# EAGLE design poe (EAGLE 6.4)
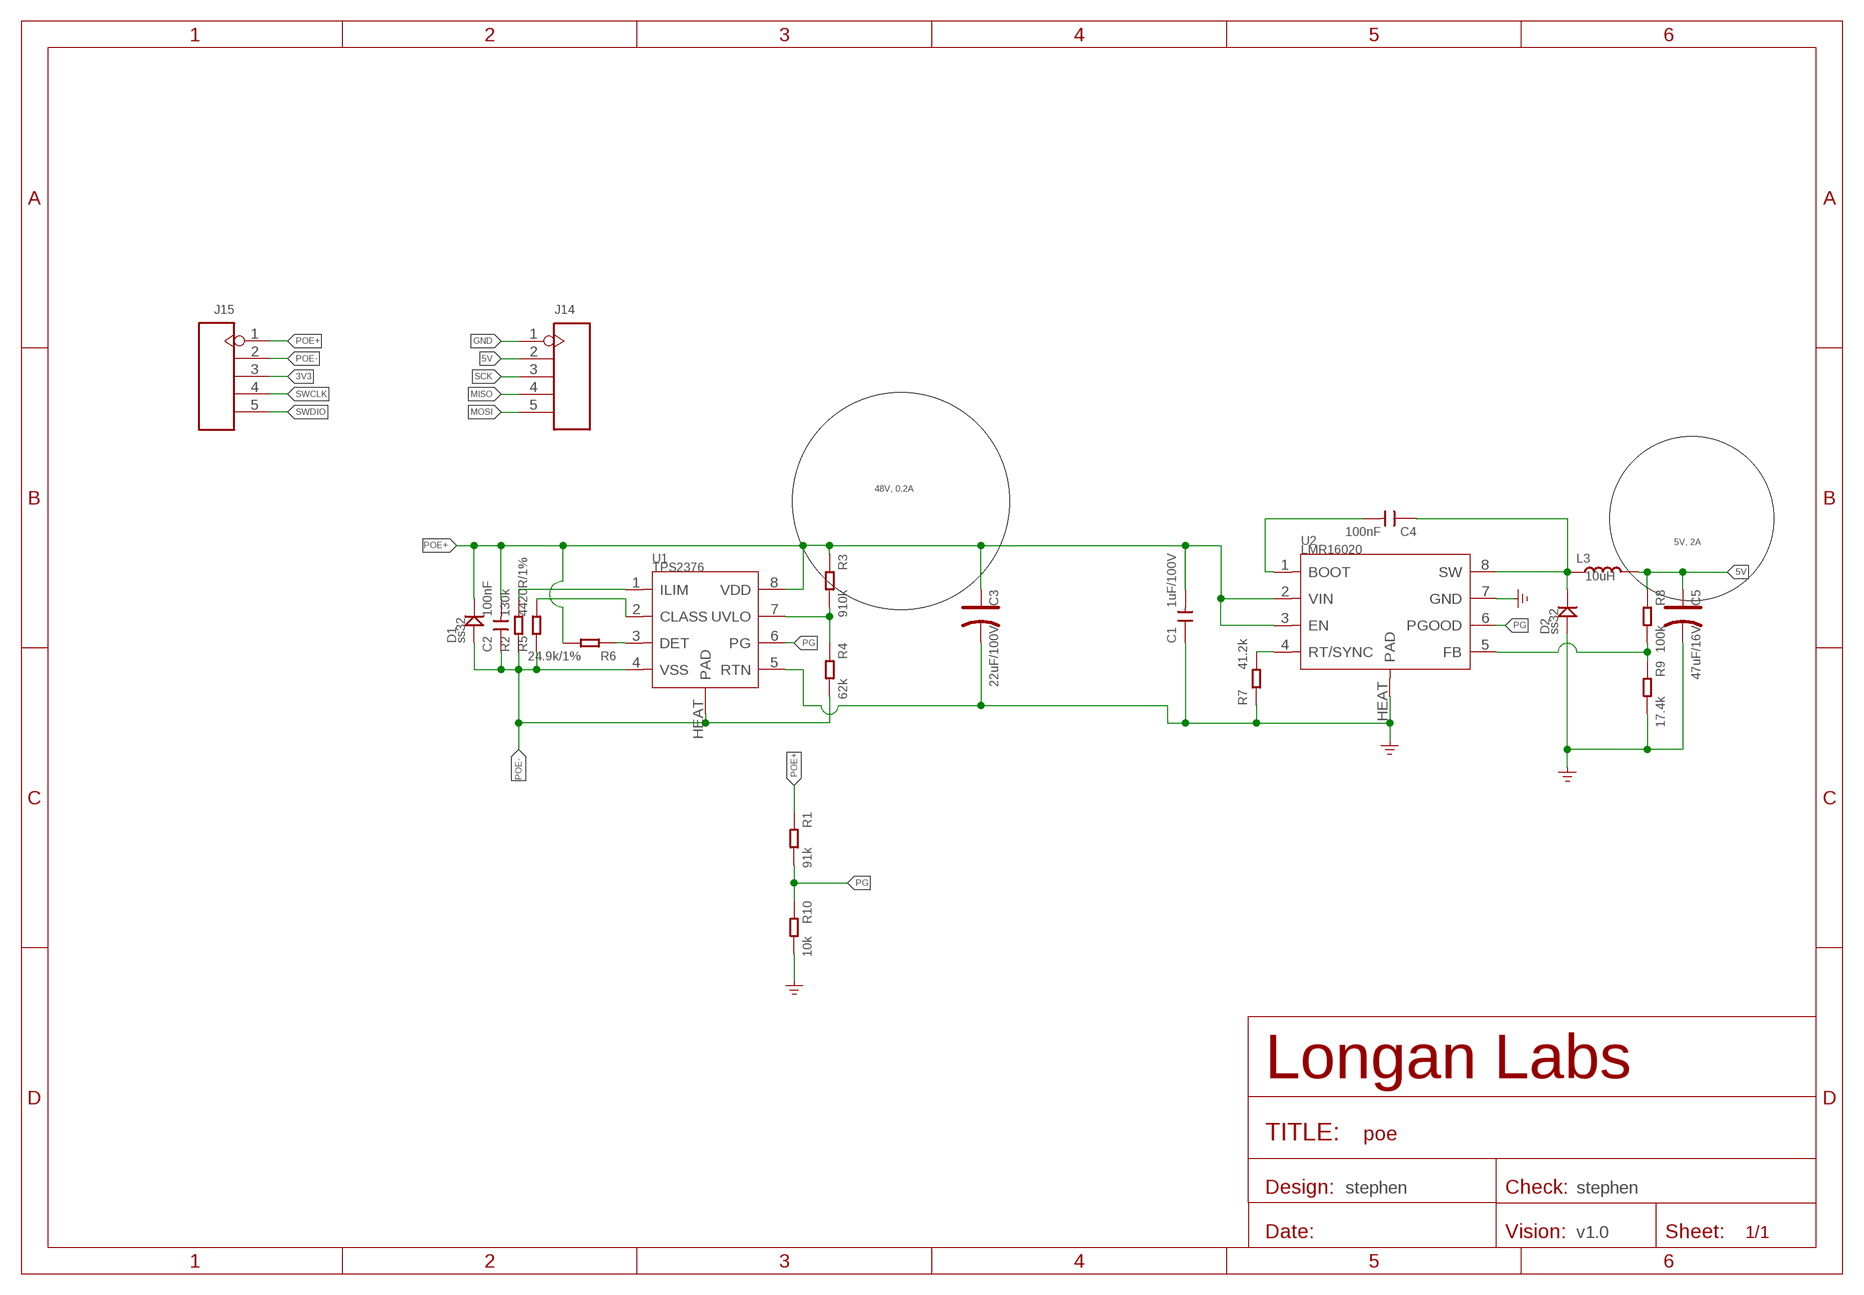
[diagram p0: schematic, sheet 1]

## Parts
C1  1uF/100V  CAP-0805  [C0805]
C2  100nF  CAP-0805  [C0805]
C3  22uF/100V  CAP-POLAR-ELECTRO-E  [ELECTRO-SMD-E-7.8MM]
C4  100nF  CAP-0603  [C0603]
C5  47uF/16V  CAP-POLAR-AVX-B  [AVX-B]
D1  ss32  DIODE'SMA'  [DO-214AC]
D2  ss32  DIODE'SMA'  [DO-214AC]
J14  HEADER-5P-2.0  [H5-2.0]
J15  HEADER-5P-2.0  [H5-2.0]
L3  10uH  INDUCTOR-6.6X7.1  [INT2-SMD-6.6X7.1X3MM]
R1  91k  RES-0603  [R0603]
R2  130k  RES-0603  [R0603]
R3  910k  RES-0603  [R0603]
R4  62k  RES-0603  [R0603]
R5  4420R/1%  RES-0603  [R0603]
R6  24.9k/1%  RES-0603  [R0603]
R7  41.2k  RES-0603  [R0603]
R8  100k  RES-0603  [R0603]
R9  17.4k  RES-0603  [R0603]
R10  10k  RES-0603  [R0603]
U1  TPS2376  CONTROLLER-TPS2376DDA-H  [SOP8G-1.27-5X3.9MM]
U2  LMR16020  PMIC-LMR16020  [SOP8G-1.27-5X3.9MM]

## Nets
3V3: J15.3
5V [usbvcc]: C5.+ J14.2 L3.2 R8.1
GND: C1.1 C3.- C5.- D2.1(+) J14.1 R7.1 R9.2 R10.2 U1.5(RTN) U2.7(GND) U2.HEAT(PAD) ; supply symbol labelled GND_POWER
MISO: J14.4
MOSI: J14.5
N$2: R2.2 U1.1(ILIM)
N$3: R5.2 U1.2(CLASS)
N$4: R6.1 U1.3(DET)
N$5: C4.2 U2.1(BOOT)
N$6: R3.2 R4.1 U1.7(UVLO)
N$7: R7.2 U2.4(RT/SYNC)
N$10: R8.2 R9.1 U2.5(FB)
N$11: C4.1 D2.2(-) L3.1 U2.8(SW)
PG: R1.2 R10.1 U1.6(PG) U2.6(PGOOD)
POE+: C1.2 C2.2 C3.+ D1.2(-) J15.1 R1.1 R3.1 R6.2 U1.8(VDD) U2.2(VIN) U2.3(EN)
POE-: C2.1 D1.1(+) J15.2 R2.1 R4.2 R5.1 U1.4(VSS) U1.HEAT(PAD)
SCK: J14.3
SWCLK: J15.4
SWDIO: J15.5

## Notes on the sheet
- 48V, 0.2A
- 5V, 2A
- stephen | stephen
- v1.0

## Library data of the parts
C1 C2 C4 = Discrete-new:CAP: Ceramic Capacitors
C3 C5 = Discrete-new:CAP-POLAR: Electrolytic Capacitors,Tantalum Capacitors and Super Capacitors
D1 D2 = Discrete-new:DIODE
J14 J15 = Connector-new:HEADER-5P
L3 = Discrete-new:INDUCTOR
R1-R10 = Discrete-new:RES
U1 = IC-new:CONTROLLER-TPS2376DDA-H
U2 = PMIC:PMIC-LMR16020

## Net classes
0 default: width 0.152 mm, drill 0.254 mm, clearance 0.152 mm
3 usbvcc: width 0.127 mm, drill 0.305 mm, clearance 0.203 mm

## Board
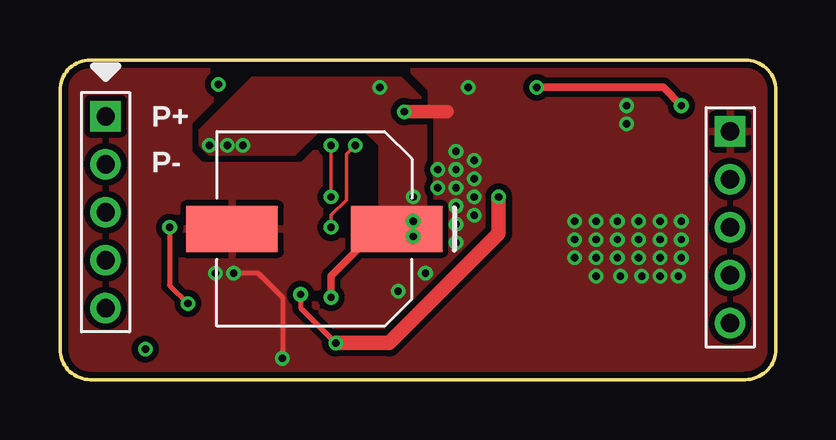
[diagram p1: board, top side]
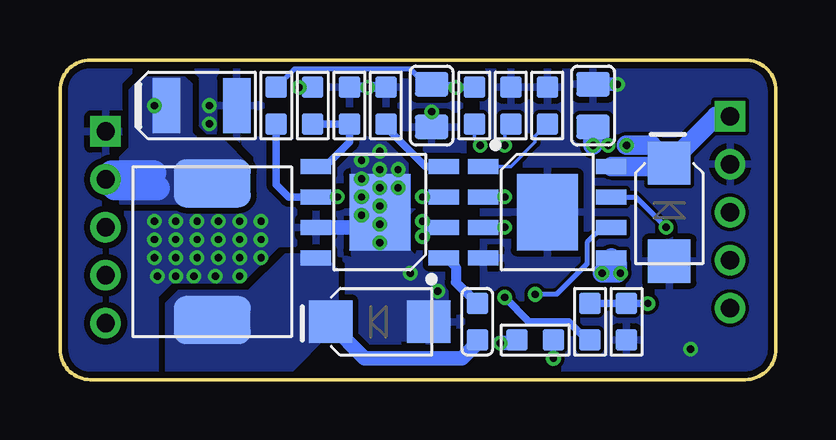
[diagram p2: board, bottom side, seen from below]

Size 29.84 x 13.34 mm. Coordinates in mm from the lower left corner, seen from the top.
Outline: 1.27,0 28.57,0 arc90 29.84,1.27 29.84,12.06 arc90 28.57,13.34 1.27,13.34 arc90 0,12.06 0,1.27 arc90 1.27,0
Copper layers (1*16): Top 0.035mm / dielectric 1.5mm / Bottom 0.035mm
Design rules "default *": minimum track width 6mil, minimum drill 12mil, track to track 6mil, track to pad 6mil, pad to pad 6mil, via to via 6mil, smd to smd 0mil, copper to edge 10mil, drill to drill 10mil, minimum pad ring 10mil, minimum via ring 6mil, stop-mask expansion 2mil, vias tented up to drill 25mil, thermal gap 10mil

### Footprints (pad centres in the part's own frame; a part is rotated, then mirrored left to right if it is on the bottom)
C0805 = smd 1.016 x 1.397: 1 -0.889,0; 2 0.889,0
ELECTRO-SMD-E-7.8MM = smd 3.81 x 1.905: + 3.429,0; - -3.429,0
C0603 = smd 0.889 x 0.889: 1 -0.762,0; 2 0.762,0
AVX-B = smd 1.143 x 2.286: + 1.46,0; - -1.46,0
DO-214AC = smd 1.8 x 1.77: 1 2.042,0; 2 -2.042,0
H5-2.0 = drill 0.762 pad 1.27 square: 1 0,4 | drill 0.762 pad 1.27: 2 0,2; 3 0,0; 4 0,-2; 5 0,-4
INT2-SMD-6.6X7.1X3MM = smd 2 x 3.2: 1 -2.85,0; 2 2.85,0
R0603 = smd 0.889 x 0.889: 1 -0.762,0; 2 0.762,0
SOP8G-1.27-5X3.9MM = smd 0.635 x 1.27: 1 -1.905,-2.667; 2 -0.635,-2.667; 3 0.635,-2.667; 4 1.905,-2.667; 5 1.905,2.667; 6 0.635,2.667; 7 -0.635,2.667; 8 -1.905,2.667 | smd 3.175 x 2.54: HEAT 0,0

### Placement (x,y rotation side)
C1  14.35,11.43 90 bottom
C2  7.62,11.43 270 bottom
C3  10.6,6.29 0 top
C4  12.45,2.41 90 bottom
C5  23.94,11.43 180 bottom
D1  4.45,6.99 270 bottom
D2  16.51,2.41 0 bottom
J14  27.94,6.35 0 top
J15  1.91,6.99 0 top
L3  23.5,5.33 90 bottom
R1  20.83,11.43 270 bottom
R2  9.53,11.43 270 bottom
R3  7.75,2.41 90 bottom
R4  6.22,2.41 270 bottom
R5  11.05,11.43 270 bottom
R6  12.57,11.43 90 bottom
R7  16.26,11.43 270 bottom
R8  19.3,11.43 270 bottom
R9  17.78,11.43 90 bottom
R10  10.03,1.65 0 bottom
U1  9.53,6.99 270 bottom
U2  16.51,6.99 90 bottom

### Tracks (layer width: path | path; a pad name or v marks a point on that pad's centre or on a via)
5V  (via drill 0.3 pad 0.61)
  Top 0.305: v19.88,12.19 25.15,12.19 v25.91,11.43
  Bottom 0.305: R8.1 v19.88,12.19
  Bottom 1.016: 25.91,8.64 27.69,8.64 27.94,8.38 J14.2 27.91,8.35 27.56,8 25.78,8
  pour Bottom (isolate 0.254, no thermals): 24.64,12.57 26.42,12.57 26.92,12.06 26.92,9.65 27.3,9.27 27.3,7.37 22.61,7.37 22.1,7.87 22.1,9.02 22.99,9.91 24,9.91 24.38,10.29 24.38,12.32
GND  (via drill 0.3 pad 0.51, 0.3 pad 0.61)
  Top 0.203: v7.24,4.45 8.26,4.45 9.27,3.43 v9.27,0.89
  Top 0.559: v14.35,11.18 16.13,11.18
  Bottom 0.203: v9.27,0.89 R10.2
  Bottom 0.406: 16.13,12.19 R7.1 v17.02,12.19 R9.2
  Bottom 0.61: U2.7 17.4,6.35 17.27,6.48
  Bottom 0.813: v7.24,4.45 6.6,4.45 6.6,4.83 U1.5
  other vias: 16.51,7.24 16.51,8.76 17.27,6.86 16.51,9.53 15.24,4.45 14.1,3.68 23.62,11.43 23.62,10.67 6.48,4.45 17.27,9.14 17.27,8.38 17.27,7.62 16.51,8 16.51,6.48 16.51,5.71 15.75,8.76 15.75,8 21.46,6.6 22.35,6.6 23.24,6.6 24.13,6.6 25.02,6.6 25.91,6.6 21.46,5.84 22.35,5.84 23.24,5.84 24.13,5.84 25.02,5.84 25.91,5.84 21.46,5.08 22.35,5.08 23.24,5.08 24.13,5.08 25.02,5.08 25.91,5.08 22.35,4.32 23.37,4.32 24.26,4.32 25.02,4.32 25.78,4.32
  pour Bottom (isolate 0.254, no thermals): 13.72,2.29 13.72,3.81 15.37,5.46 15.37,9.02 16.26,9.91 17.02,9.91 17.65,9.27 17.65,5.21 15.88,3.43 15.88,1.91 15.62,1.65 13.97,1.65 13.72,1.91
  pour Top (isolate 0.254, rank 6): -0.51,13.34 29.84,13.34 29.84,0 -0.51,0
  pour Bottom (isolate 0.254, rank 6): 12.7,13.21 29.84,13.34 29.84,0 12.7,-0.13
  pour Bottom: 22.35,11.81 23.62,11.81 23.88,11.56 23.88,10.54 23.75,10.41 22.61,10.41 22.35,10.67
N$2
  Bottom 0.152: U1.1 11.05,8.89 10.03,9.91 10.03,10.16 R2.2
N$3  (via drill 0.3 pad 0.61)
  Top 0.152: v11.3,7.62 v11.3,9.78
  Bottom 0.152: U1.2 v11.3,7.62 | v11.3,9.78 11.3,10.41 R5.2
N$4  (via drill 0.3 pad 0.61)
  Top 0.152: 12.06,9.53 v12.32,9.78 11.94,9.4 11.94,7.49 11.3,6.86 v11.3,6.35
  Bottom 0.152: U1.3 v11.3,6.35 | R6.1 12.57,10.03 v12.32,9.78
N$5
  Bottom 0.406: U2.1 13.72,5.08 13.34,4.7 13.34,4.06 C4.2
N$6  (via drill 0.3 pad 0.51, 0.3 pad 0.61)
  Top 0.203: v4.57,6.35 4.57,3.94 v5.33,3.17
  Bottom 0.203: U1.7 5.84,7.62 v4.57,6.35
  Bottom 0.305: R3.2 R4.1 v5.33,3.17
N$7
  Bottom 0.305: U2.4 14.61,8.89 15.94,10.22 16,10.29 16.26,10.54 R7.2
N$10
  Bottom 0.305: U2.5 18.8,8.89 17.78,9.91 R9.1 R8.2
N$11
  Bottom 0.61: C4.1 12.45,1.52 13.08,0.89 17.14,0.89 18.55,2.3 D2.2
  pour Bottom (isolate 0.254, no thermals): 19.3,5.21 20.45,5.21 21.97,3.68 24.89,3.68 25.4,3.17 25.4,0.25 25.15,0 20.57,0 18.29,2.29 18.29,4.57 18.92,5.21
PG  (via drill 0.3 pad 0.51, 0.3 pad 0.61)
  Top 0.203: v11.49,1.52 10.03,2.98 v10.03,3.56
  Top 0.61: v18.29,7.62 18.29,6.1 13.72,1.52 v11.49,1.52
  Bottom 0.203: U1.6 7.24,6.35 7.87,5.71 7.87,4.83 9.14,3.56 v10.03,3.56 | R10.1 10.92,1.52
  Bottom 0.305: R1.2 20.83,8.13 20.32,7.62 U2.6 v18.29,7.62
  Bottom 0.61: v11.49,1.52 10.92,1.52
POE+  (via drill 0.3 pad 0.51, 0.3 pad 0.61)
  Top 0.305: v11.3,3.43 11.3,4.32 12.95,5.97 v14.73,5.97
  Bottom 0.203: R1.1 20.07,12.95 15.24,12.95 14.86,12.57 14.61,12.57 C1.2 13.46,12.32 v13.34,12.19
  Bottom 0.305: R3.1 7.87,1.65 8.64,2.41 10.29,2.41 v11.3,3.43 | R6.2 v13.34,12.19 | U2.3 v14.73,7.62 | 14.35,6.35 14.48,6.48 14.61,6.48 v14.73,6.6 14.48,6.35 U2.2 14.35,6.35 | 14.35,6.35 v14.73,5.97
  Bottom 0.813: J15.1 2.49,10.98 D1.2 | v6.22,9.78 5.2,9.78 D1.2 | U1.8 4.58,8.89 D1.2 | C2.2 v7.62,9.78
  other vias: 6.99,9.78
  pour Top (isolate 0.254, no thermals): 6.35,9.4 9.78,9.4 10.79,10.41 12.7,10.41 13.34,9.78 13.34,5.84 13.72,5.46 15.11,5.46 15.24,5.59 15.24,11.56 14.22,12.57 8,12.57 5.84,10.41 5.84,9.78 6.22,9.4
POE-  (via drill 0.3 pad 0.51, 0.3 pad 0.61)
  Bottom 0.559: v6.6,12.32 C2.1
  other vias: 3.56,1.27
  pour Bottom: -0.51,13.34 12.19,13.34 12.19,-0.13 -0.51,-0.13

### Text on the board
tPlace: P+ | P-